# EasyEDA schematic r1.json
TITLE: Sheet_1; REV: 1.0; Date: 2020-10-19; Sheet: 1/1; Drawn By: barisayyildiz; Company: Your Company
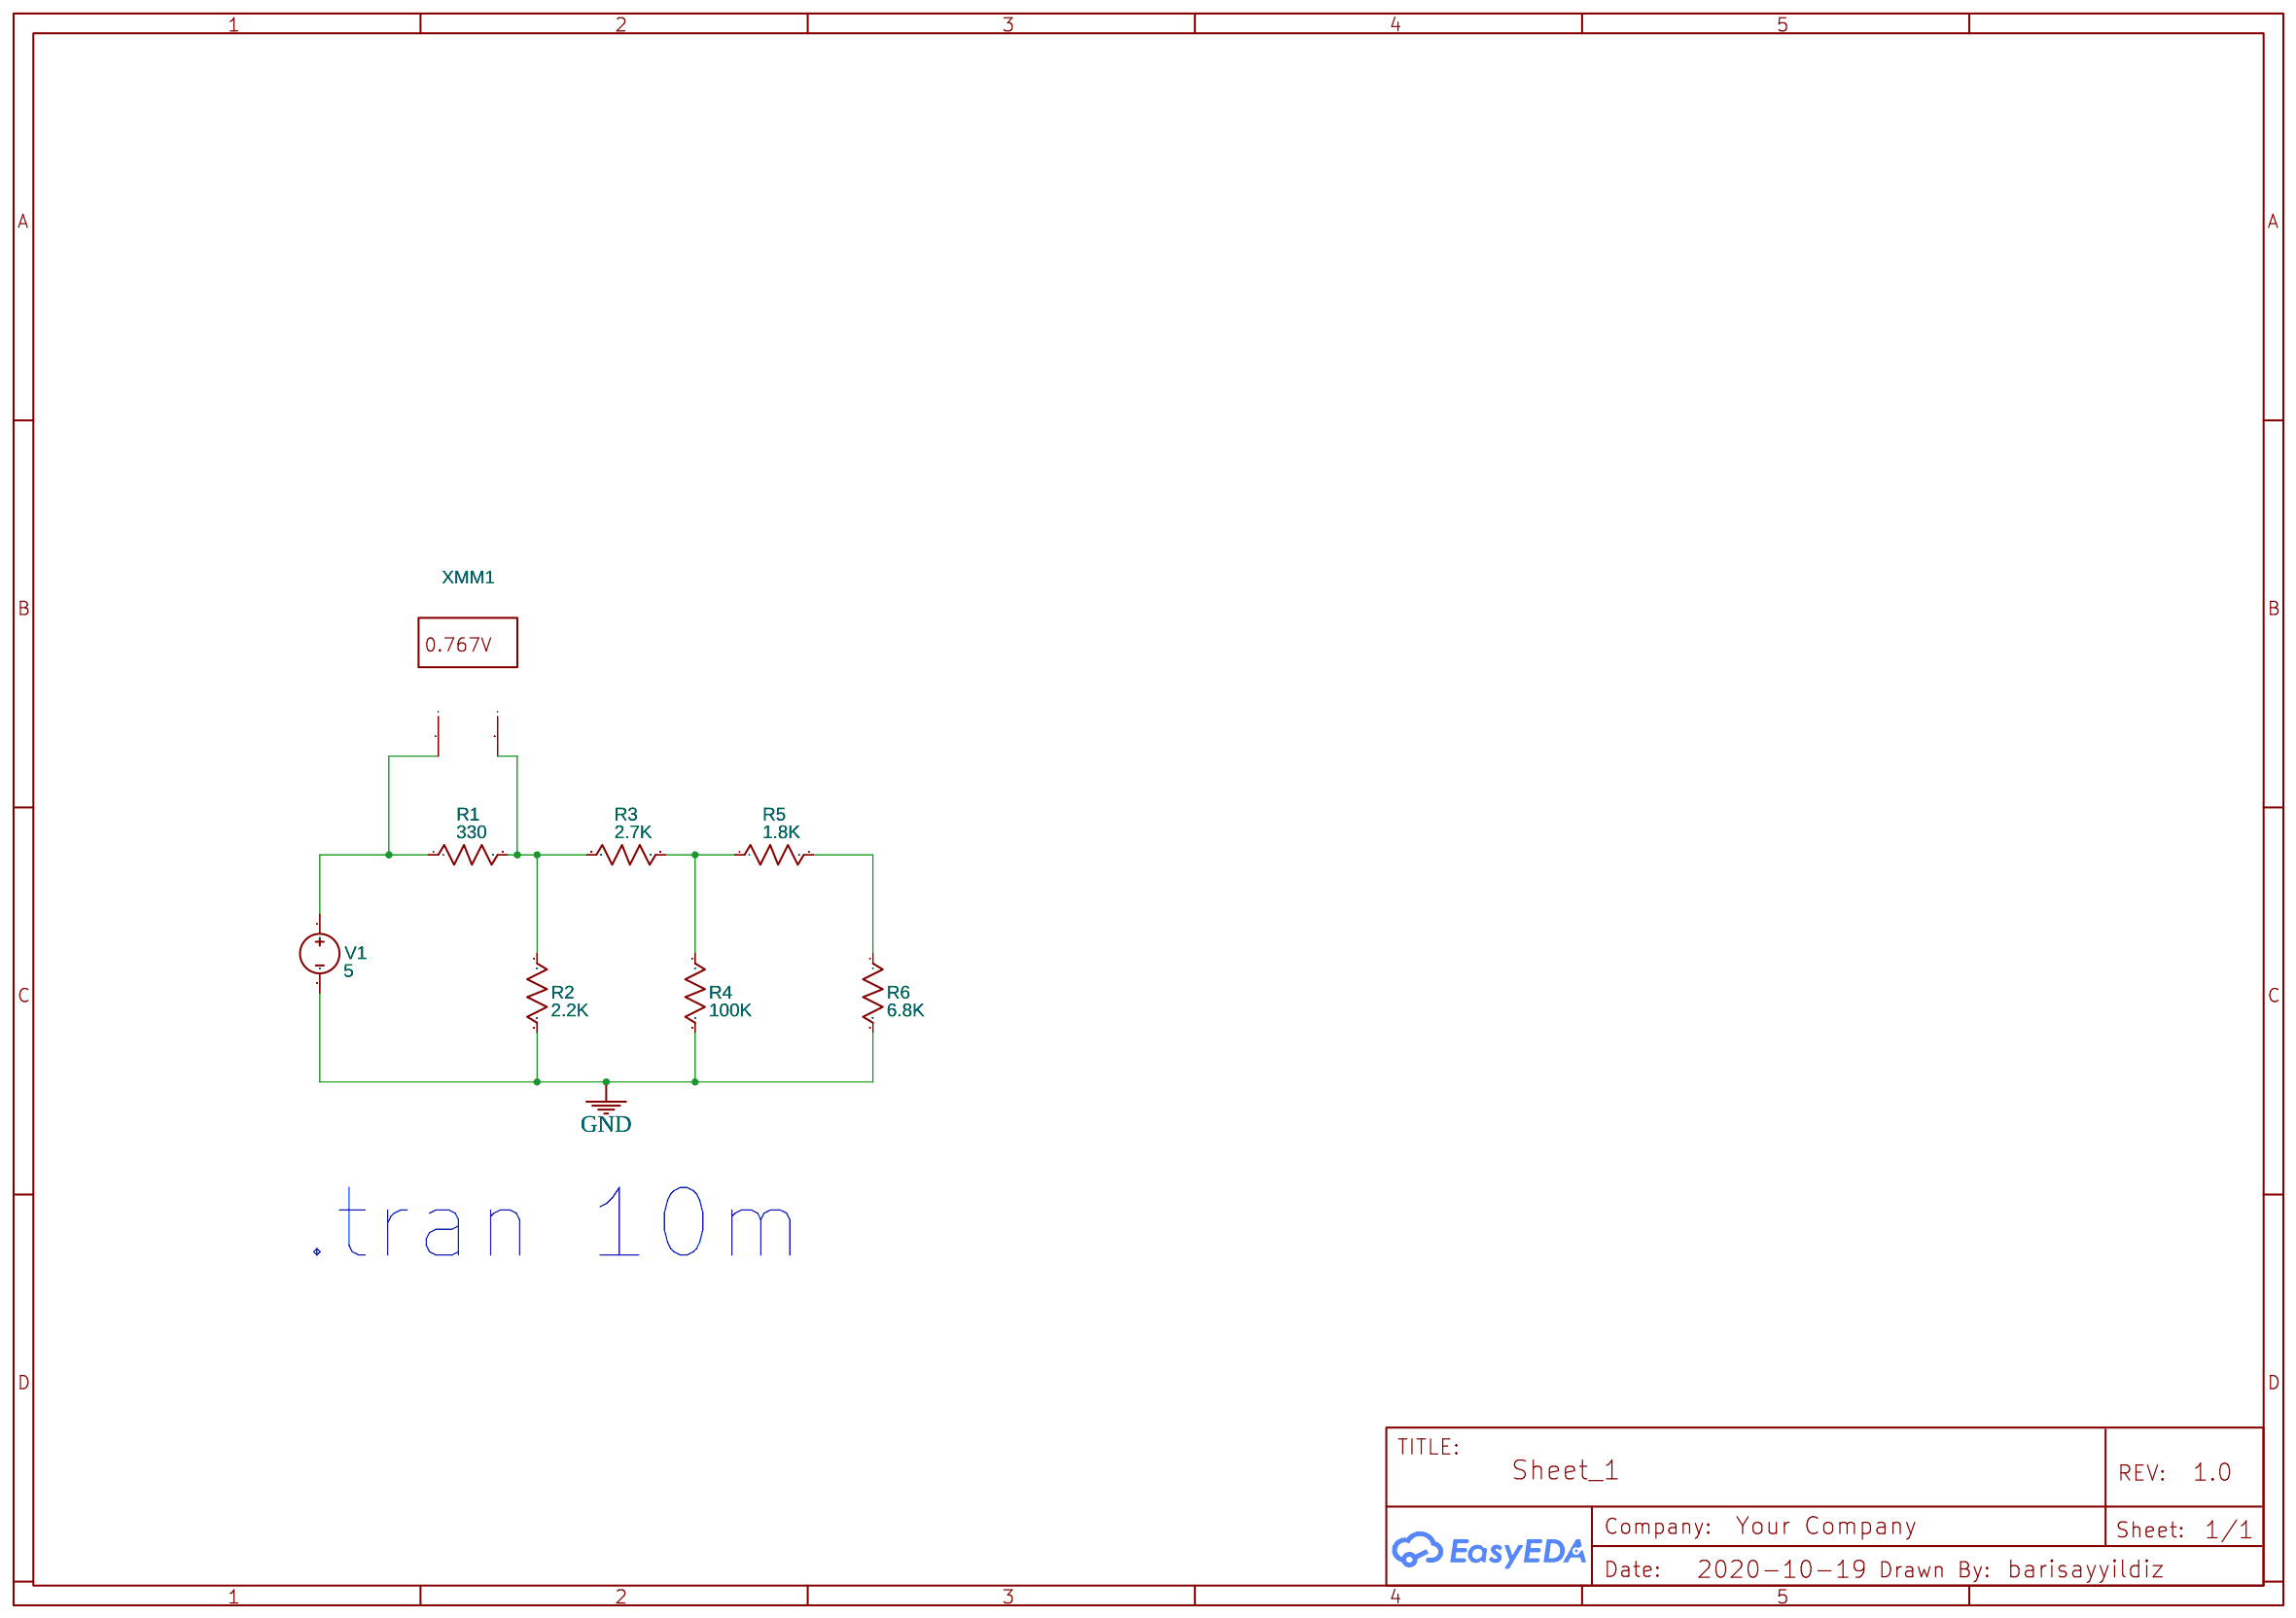
[diagram p0: schematic sheet]

## Parts
R1  330  [AXIAL-0.3]
R2  2.2K  [AXIAL-0.3]
R3  2.7K  [AXIAL-0.3]
R4  100K  [AXIAL-0.3]
R5  1.8K  [AXIAL-0.3]
R6  6.8K  [AXIAL-0.3]
V1  5  [HDR1X2]
XMM1  Multimeter

## Library data of the parts
R1-R6 = Resistor_US: Resistance: 1k; Contributor: EasyEDA; Supplier: YUJING
V1 = VDC: Contributor: EasyEDA; sim: true
XMM1 = MULTIMETER: Supplier: LCSC; Multimeter Type: Voltmeter; Power Type: AC; Voltmeter resistance: 10μ; Ammeter resistance: 1G; NameDisplay: 0; Contributor: EasyEDA; sim: true

## Nets
GND: R2.2 R4.2 R6.2 V1.2
Net-(R1-1): R1.1 V1.1 XMM1.1(+)
Net-(R1-2): R1.2 R2.1 R3.1 XMM1.2(I)
Net-(R3-2): R3.2 R4.1 R5.1
Net-(R5-2): R5.2 R6.1

## Notes on the sheet
- .tran 10m
